# Altium schematic sheet GSB-S01-V00-GeneralSensorBoard.SchDoc
size A3
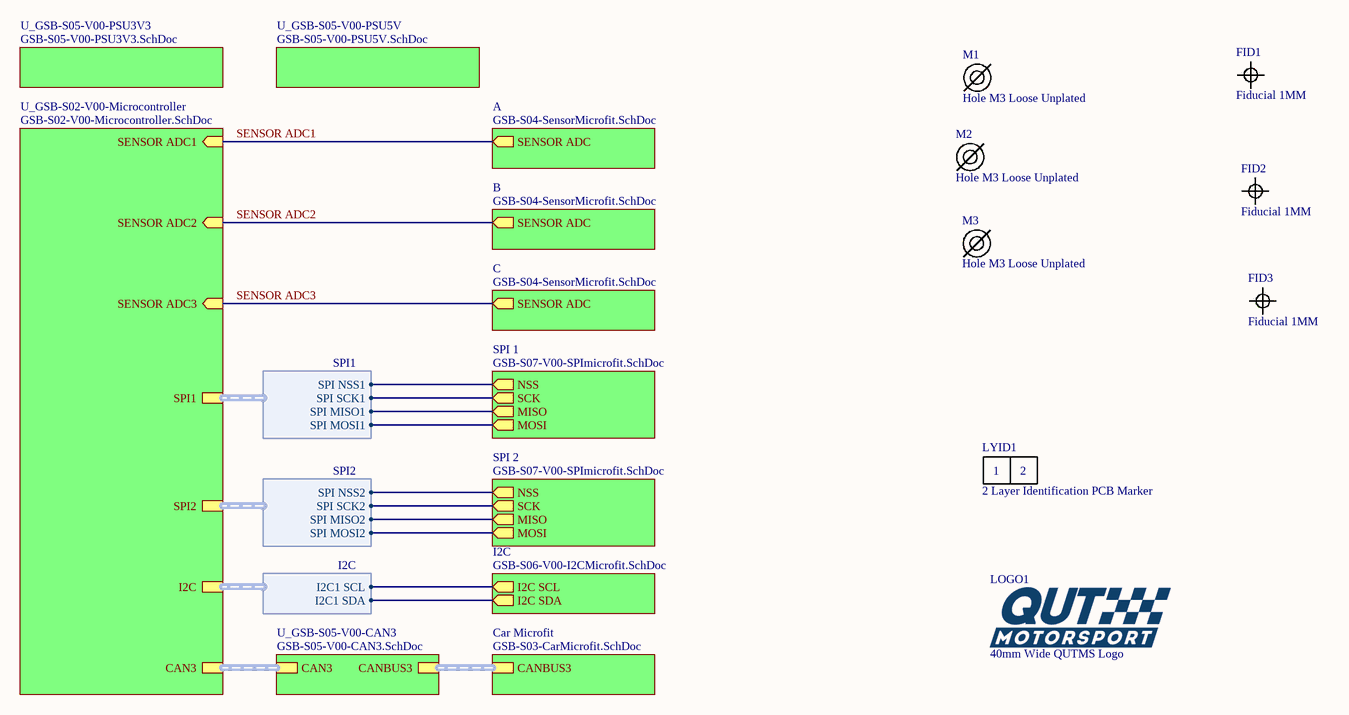
[diagram p0: GSB-S01-V00-GeneralSensorBoard.SchDoc]

## Parts
FID1  Fiducial 1MM  [FIDUCIAL 1MM]
FID2  Fiducial 1MM  [FIDUCIAL 1MM]
FID3  Fiducial 1MM  [FIDUCIAL 1MM]
LOGO1  40mm Wide QUTMS Logo  [QUTMS LOGO 40MM]
LYID1  2 Layer Identification PCB Marker  [LAYER IDENT 2]
M1  Hole M3 Loose Unplated  [M3.5 UNPLATED]
M2  Hole M3 Loose Unplated  [M3.5 UNPLATED]
M3  Hole M3 Loose Unplated  [M3.5 UNPLATED]

## Sub-sheets
A = GSB-S04-SensorMicrofit.SchDoc: SENSOR ADC (out)
B = GSB-S04-SensorMicrofit.SchDoc: SENSOR ADC (out)
C = GSB-S04-SensorMicrofit.SchDoc: SENSOR ADC (out)
Car Microfit = GSB-S03-CarMicrofit.SchDoc: CANBUS3 (harness CANBUS3)
I2C = GSB-S06-V00-I2CMicrofit.SchDoc: I2C SCL (out), I2C SDA (out)
SPI 1 = GSB-S07-V00-SPImicrofit.SchDoc: NSS (out), SCK (out), MISO (out), MOSI (out)
SPI 2 = GSB-S07-V00-SPImicrofit.SchDoc: NSS (out), SCK (out), MISO (out), MOSI (out)
U_GSB-S02-V00-Microcontroller = GSB-S02-V00-Microcontroller.SchDoc: I2C (harness I2C), CAN3 (harness CAN3), SPI1 (harness SPI1), SPI2 (harness SPI2), SENSOR ADC2 (in), SENSOR ADC1 (in), SENSOR ADC3 (in)
U_GSB-S05-V00-CAN3 = GSB-S05-V00-CAN3.SchDoc: CANBUS3 (harness CANBUS3), CAN3 (harness CAN3)
U_GSB-S05-V00-PSU3V3 = GSB-S05-V00-PSU3V3.SchDoc: no entries
U_GSB-S05-V00-PSU5V = GSB-S05-V00-PSU5V.SchDoc: no entries

## Harnesses
SPI1: SPI SCK1, SPI MISO1, SPI NSS1, SPI MOSI1
SPI2: SPI SCK2, SPI MISO2, SPI NSS2, SPI MOSI2
I2C: I2C1 SCL, I2C1 SDA

## Nets
SENSOR ADC1: sheet U_GSB-S02-V00-Microcontroller/SENSOR ADC1, sheet A/SENSOR ADC
SENSOR ADC2: sheet U_GSB-S02-V00-Microcontroller/SENSOR ADC2, sheet B/SENSOR ADC
SENSOR ADC3: sheet U_GSB-S02-V00-Microcontroller/SENSOR ADC3, sheet C/SENSOR ADC
(unnamed): sheet SPI 1/NSS, sheet U_GSB-S02-V00-Microcontroller/SPI1.SPI NSS1
(unnamed): sheet SPI 1/SCK, sheet U_GSB-S02-V00-Microcontroller/SPI1.SPI SCK1
(unnamed): sheet SPI 1/MISO, sheet U_GSB-S02-V00-Microcontroller/SPI1.SPI MISO1
(unnamed): sheet SPI 1/MOSI, sheet U_GSB-S02-V00-Microcontroller/SPI1.SPI MOSI1
(unnamed): sheet SPI 2/NSS, sheet U_GSB-S02-V00-Microcontroller/SPI2.SPI NSS2
(unnamed): sheet SPI 2/SCK, sheet U_GSB-S02-V00-Microcontroller/SPI2.SPI SCK2
(unnamed): sheet SPI 2/MISO, sheet U_GSB-S02-V00-Microcontroller/SPI2.SPI MISO2
(unnamed): sheet SPI 2/MOSI, sheet U_GSB-S02-V00-Microcontroller/SPI2.SPI MOSI2
(unnamed): sheet I2C/I2C SCL, sheet U_GSB-S02-V00-Microcontroller/I2C.I2C1 SCL
(unnamed): sheet I2C/I2C SDA, sheet U_GSB-S02-V00-Microcontroller/I2C.I2C1 SDA

## Buses and harness runs
harness sheet Car Microfit/CANBUS3 = sheet U_GSB-S05-V00-CAN3/CANBUS3
harness sheet U_GSB-S02-V00-Microcontroller/CAN3 = sheet U_GSB-S05-V00-CAN3/CAN3

## Notes on the sheet
- (in symbol Layer Identification 2) 1; 2

## Library data of the parts
LOGO1 = QUTMS Logo 40mm
LYID1 = Layer Identification 2
M1-M3 = Hole M3 Loose Unplated: M3.5 Hole, No Plating